# EAGLE design BC_proto (EAGLE 9.0.0)
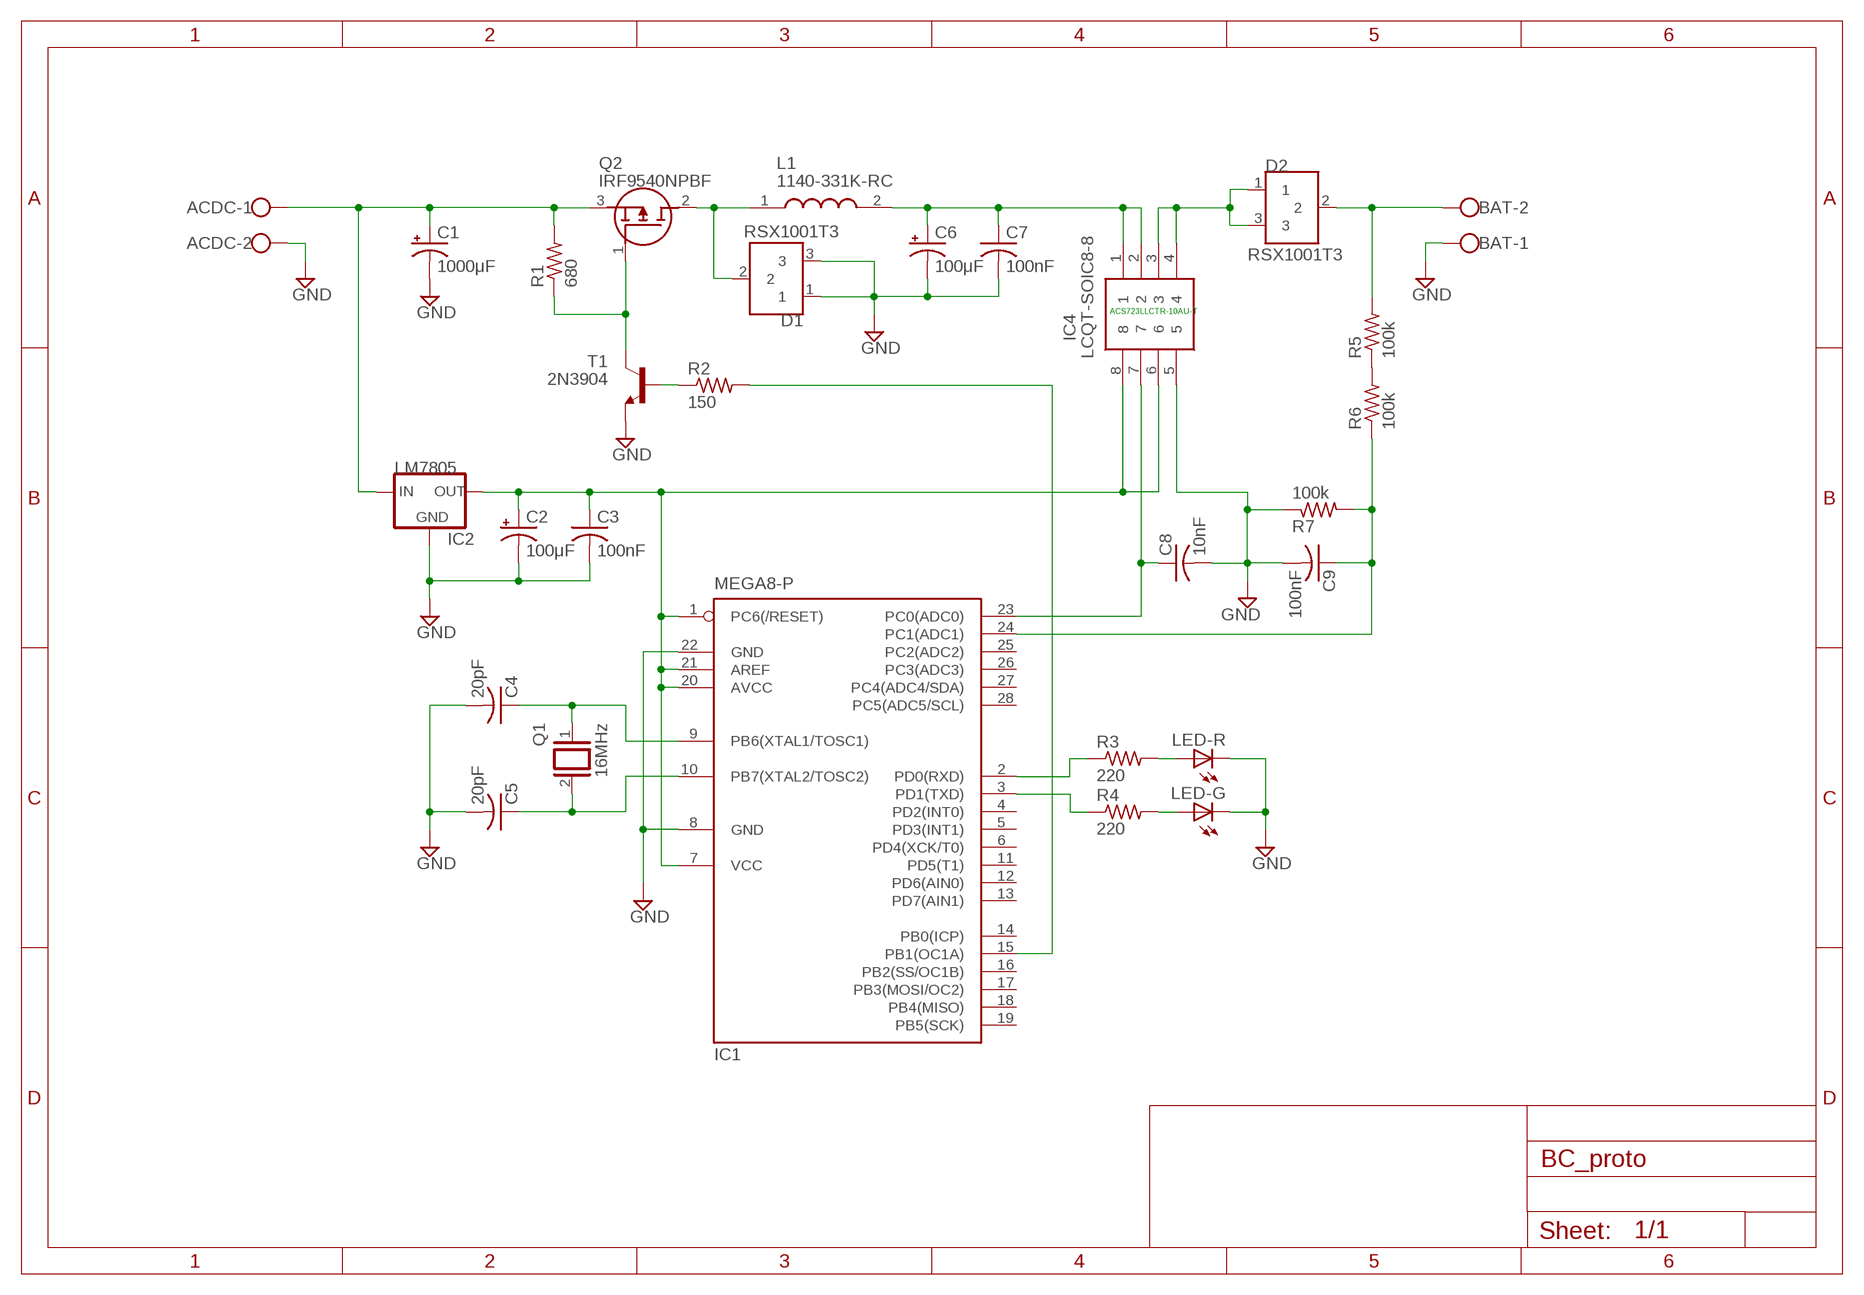
[diagram p0: schematic, sheet 1]

## Parts
ACDC  W237-102  [W237-102]
BAT  W237-102  [W237-102]
C1  1000μF  CPOL-USE7.5-16  [E7,5-16]
C2  100μF  CPOL-USE2,5-6E  [E2,5-6E]
C3  100nF  C-US050-024X044  [C050-024X044]
C4  20pF  C-US050-024X044  [C050-024X044]
C5  20pF  C-US050-024X044  [C050-024X044]
C6  100μF  CPOL-USE2,5-6E  [E2,5-6E]
C7  100nF  C-US050-024X044  [C050-024X044]
C8  10nF  C-US050-024X044  [C050-024X044]
C9  100nF  C-US050-024X044  [C050-024X044]
D1  RSX1001T3  [RSX1001T3]
D2  RSX1001T3  [RSX1001T3]
IC1  MEGA8-P  [DIL28-3]
IC2  LM7805  78XXS  [78XXS]
IC4  LCQT-SOIC8-8  W9501RC  [DIPS762W46P254L1016H160Q8N]
L1  1140-331K-RC  [1140-331K-RC]
LED-G  TLLR4400  [LED3MM]
LED-R  TLLR4400  [LED3MM]
Q1  16MHz  XTAL/S  [QS]
Q2  IRF9540NPBF  [TO254P469X1042X1967-3P]
R1  680  R-US_0204/7  [0204/7]
R2  150  R-US_0204/7  [0204/7]
R3  220  R-US_0204/7  [0204/7]
R4  220  R-US_0204/7  [0204/7]
R5  100k  R-US_0204/7  [0204/7]
R6  100k  R-US_0204/7  [0204/7]
R7  100k  R-US_0204/7  [0204/7]
T1  2N3904  [TO92]

## Nets
BUCK_OUT1: C6.+ C7.1 IC4.1 IC4.2 L1.2
BUCK_OUT2: D2.1 D2.3 IC4.3 IC4.4
BUCK_PWM1: IC1.15(PB1(OC1A)) R2.2
BUCK_PWM2: Q2.1(G) R1.1 T1.1(C)
C_SENSE: C8.1 IC1.23(PC0(ADC0)) IC4.7
GND: ACDC.2 BAT.1 C1.- C2.- C3.2 C4.2 C5.2 C6.- C7.2 C8.2 C9.2 D1.1 D1.3 IC1.8(GND) IC1.22(GND) IC2.GND IC4.5 LED-G.K(C) LED-R.K(C) R7.1 T1.3(E)
LOGIC_PWR: C2.+ C3.1 IC1.1(PC6(/RESET)) IC1.7(VCC) IC1.20(AVCC) IC1.21(AREF) IC2.OUT IC4.6 IC4.8
N$3: R2.1 T1.2(B)
N$4: C4.1 IC1.9(PB6(XTAL1/TOSC1)) Q1.1
N$5: C5.1 IC1.10(PB7(XTAL2/TOSC2)) Q1.2
N$7: IC1.2(PD0(RXD)) R3.1
N$8: IC1.3(PD1(TXD)) R4.1
N$9: LED-R.A R3.2
N$10: LED-G.A R4.2
N$13: R5.1 R6.2
N$16: D1.2 L1.1 Q2.2(D)
PWR_IN: ACDC.1 C1.+ IC2.IN Q2.3(S) R1.2
PWR_OUT: BAT.2 D2.2 R5.2
V_SENSE: C9.1 IC1.24(PC1(ADC1)) R6.1 R7.2
Unconnected: IC1.4(PD2(INT0)) IC1.5(PD3(INT1)) IC1.6(PD4(XCK/T0)) IC1.11(PD5(T1)) IC1.12(PD6(AIN0)) IC1.13(PD7(AIN1)) IC1.14(PB0(ICP)) IC1.16(PB2(SS/OC1B)) IC1.17(PB3(MOSI/OC2)) IC1.18(PB4(MISO)) IC1.19(PB5(SCK)) IC1.25(PC2(ADC2)) IC1.26(PC3(ADC3)) IC1.27(PC4(ADC4/SDA)) IC1.28(PC5(ADC5/SCL))

## Notes on the sheet
- ACS723LLCTR-10AU-T

## Library data of the parts
ACDC BAT = con-wago-500:W237-102: WAGO SCREW CLAMP; MPN: 237-102; OC_FARNELL: unknown; OC_NEWARK: 70K9898
C1 C2 C6 = rcl:CPOL-US: POLARIZED CAPACITOR, American symbol; SPICEPREFIX: C
C3-C5 C7-C9 = rcl:C-US: CAPACITOR, American symbol; SPICEPREFIX: C
D1 D2 = rasm_parts:RSX1001T3
IC1 = atmel:MEGA8-P: MICROCONTROLLER 8 Kbytes FLASH, 1 kbytes SRAM, 512 bytes EEPROM, USART, 4-channel 10 bit ADC, 2-channel 8 bit ADC Pin compatible with Atmega48, ATMega88, ATMega168 Source: avr.lbr; OC_FARNELL: unknown; OC_NEWARK: unknown
IC2 = v-reg:78XXS: VOLTAGE REGULATOR
IC4 = rasm_parts:W9501RC: 8 way 0.237in SOIC to 0.3in DIL socket Winslow Straight Through Hole Mount 1.27 mm, 2.54 mm Pitch IC Socket Adapter, 8 Pin Female SOP to 8 Pin Male DIP Source: Datasheet <http://docs-europe.electrocomponents.com/webdocs/0ff4/0900766b80ff4d69.pdf>; ALLIED_NUMBER: R1002010; ALLIED_PRICE/STOCK: https://www.alliedelec.com/winslow-adaptics-w9501rc/R1002010/; ARROW_PART_NUMBER: W9501RC; ARROW_PRICE/STOCK: http://uk.rs-online.com/web/p/products/1582878; DESCRIPTION: 8 way 0.237in SOIC to 0.3in DIL socket Winslow Straight Through Hole Mount 1.27 mm, 2.54 mm Pitch IC Socket Adapter, 8 Pin Female SOP to 8 Pin Male DIP; HEIGHT: 1.6mm; MANUFACTURER_NAME: Winslow; MANUFACTURER_PART_NUMBER: W9501RC; RS_PART_NUMBER: 1582878; RS_PRICE/STOCK: http://uk.rs-online.com/web/p/products/1582878
L1 = rasm_parts:1140-331K-RC: Bourns 330 H 10% Ferrite Bobbin Core Power Inductor, 6.1A Idc, 74m Rdc 1140 Source: Datasheet <http://www.bourns.com/docs/Product-Datasheets/1140_series.pdf>; ARROW_PART_NUMBER: 1140-331K-RC; ARROW_PRICE/STOCK: https://www.arrow.com/en/products/1140-331k-rc/bourns; DESCRIPTION: Bourns 330 H 10% Ferrite Bobbin Core Power Inductor, 6.1A Idc, 74m Rdc 1140; HEIGHT: mm; MANUFACTURER_NAME: Bourns; MANUFACTURER_PART_NUMBER: 1140-331K-RC; RS_PART_NUMBER: 1728697; RS_PRICE/STOCK: http://uk.rs-online.com/web/p/products/1728697
LED-G LED-R = led:TLLR4400: Low Current (2mA) LED 3 mm Tinted Diffused Package color RED Source: Data sheet <http://www.farnell.com/datasheets/391100.pdf>; MF: VISHAY SEMICONDUCTOR; OC_FARNELL: 1612437
Q1 = special:XTAL/S: CRYSTAL
Q2 = rasm_parts:IRF9540NPBF: Infineon IRF9540NPBF P-channel MOSFET, 23 A, 100 V HEXFET, 3-Pin TO-220AB Source: Datasheet <https://www.infineon.com/dgdl/irf9540npbf.pdf?fileId=5546d462533600a401535611cfa21dc8>; ARROW_PART_NUMBER: IRF9540NPBF; ARROW_PRICE/STOCK: https://www.arrow.com/en/products/irf9540npbf/infineon-technologies-ag; DESCRIPTION: Infineon IRF9540NPBF P-channel MOSFET, 23 A, 100 V HEXFET, 3-Pin TO-220AB; HEIGHT: 4.69mm; MANUFACTURER_NAME: Infineon; MANUFACTURER_PART_NUMBER: IRF9540NPBF; RS_PART_NUMBER: 5411225P; RS_PRICE/STOCK: http://uk.rs-online.com/web/p/products/5411225P
R1-R7 = rcl:R-US_: RESISTOR, American symbol; SPICEPREFIX: R
T1 = transistor:2N3904: NPN TRANSISTOR

## Net classes
0 default: width 0.254 mm

## Board
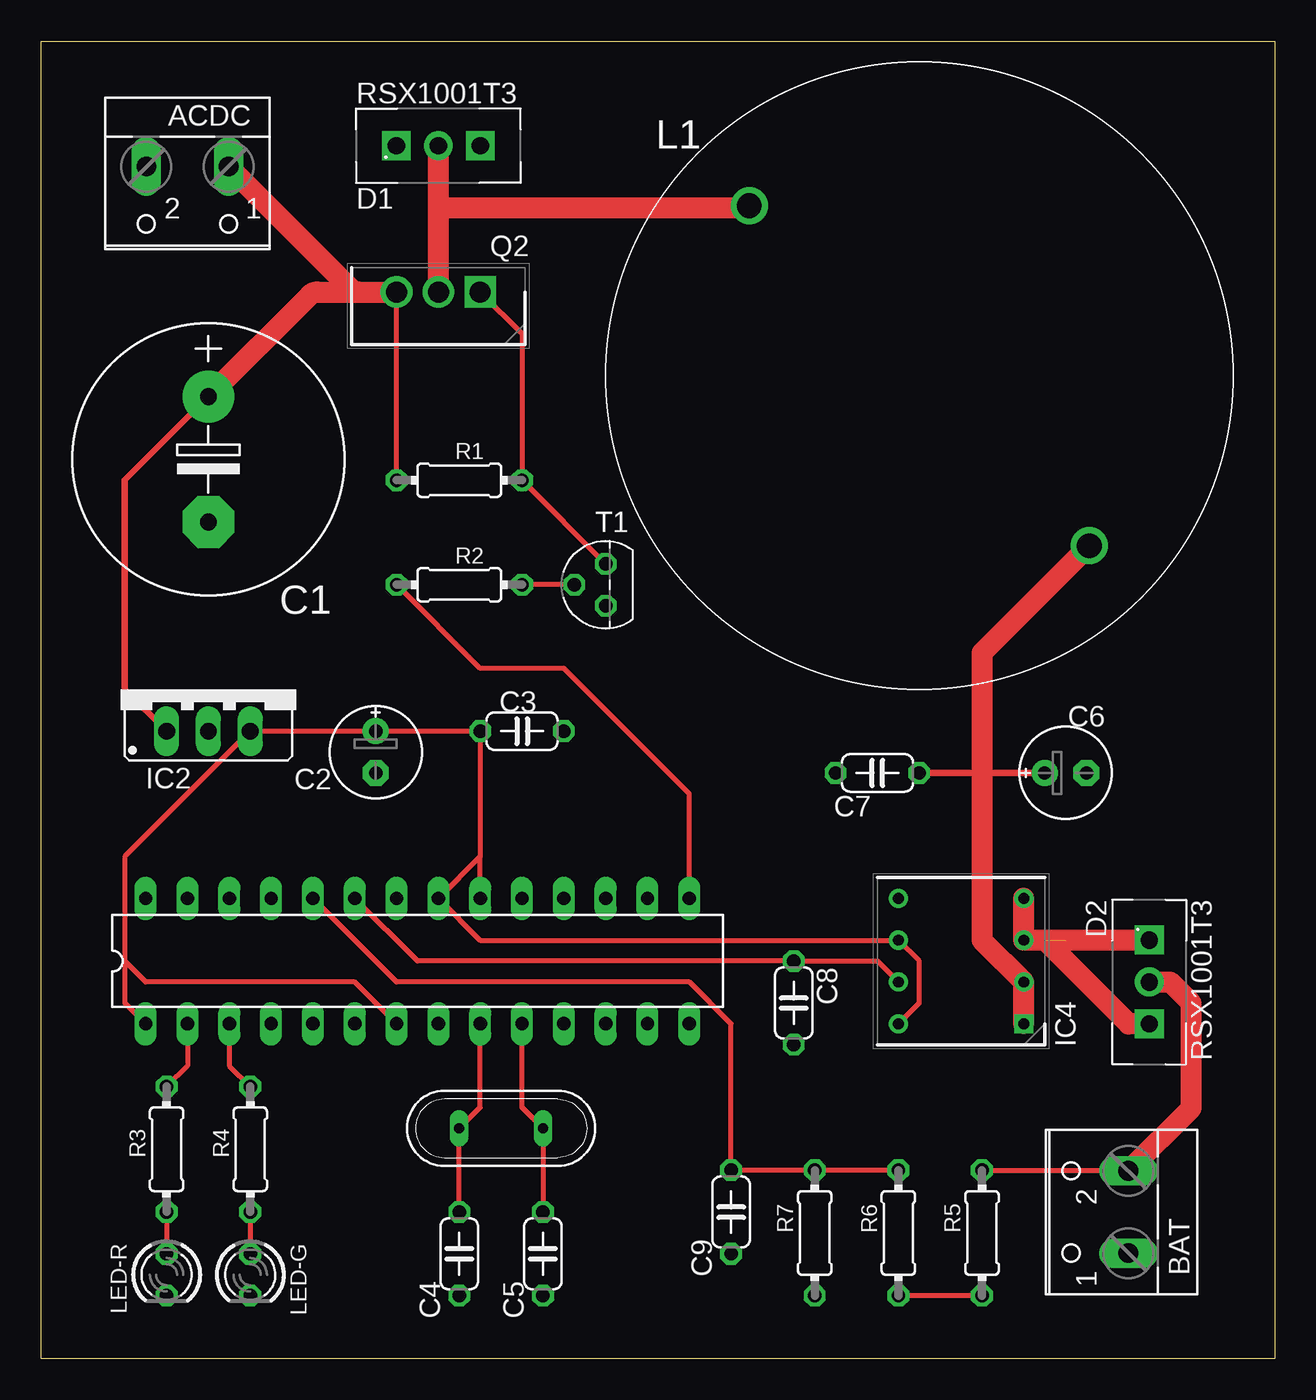
[diagram p1: board, top side]
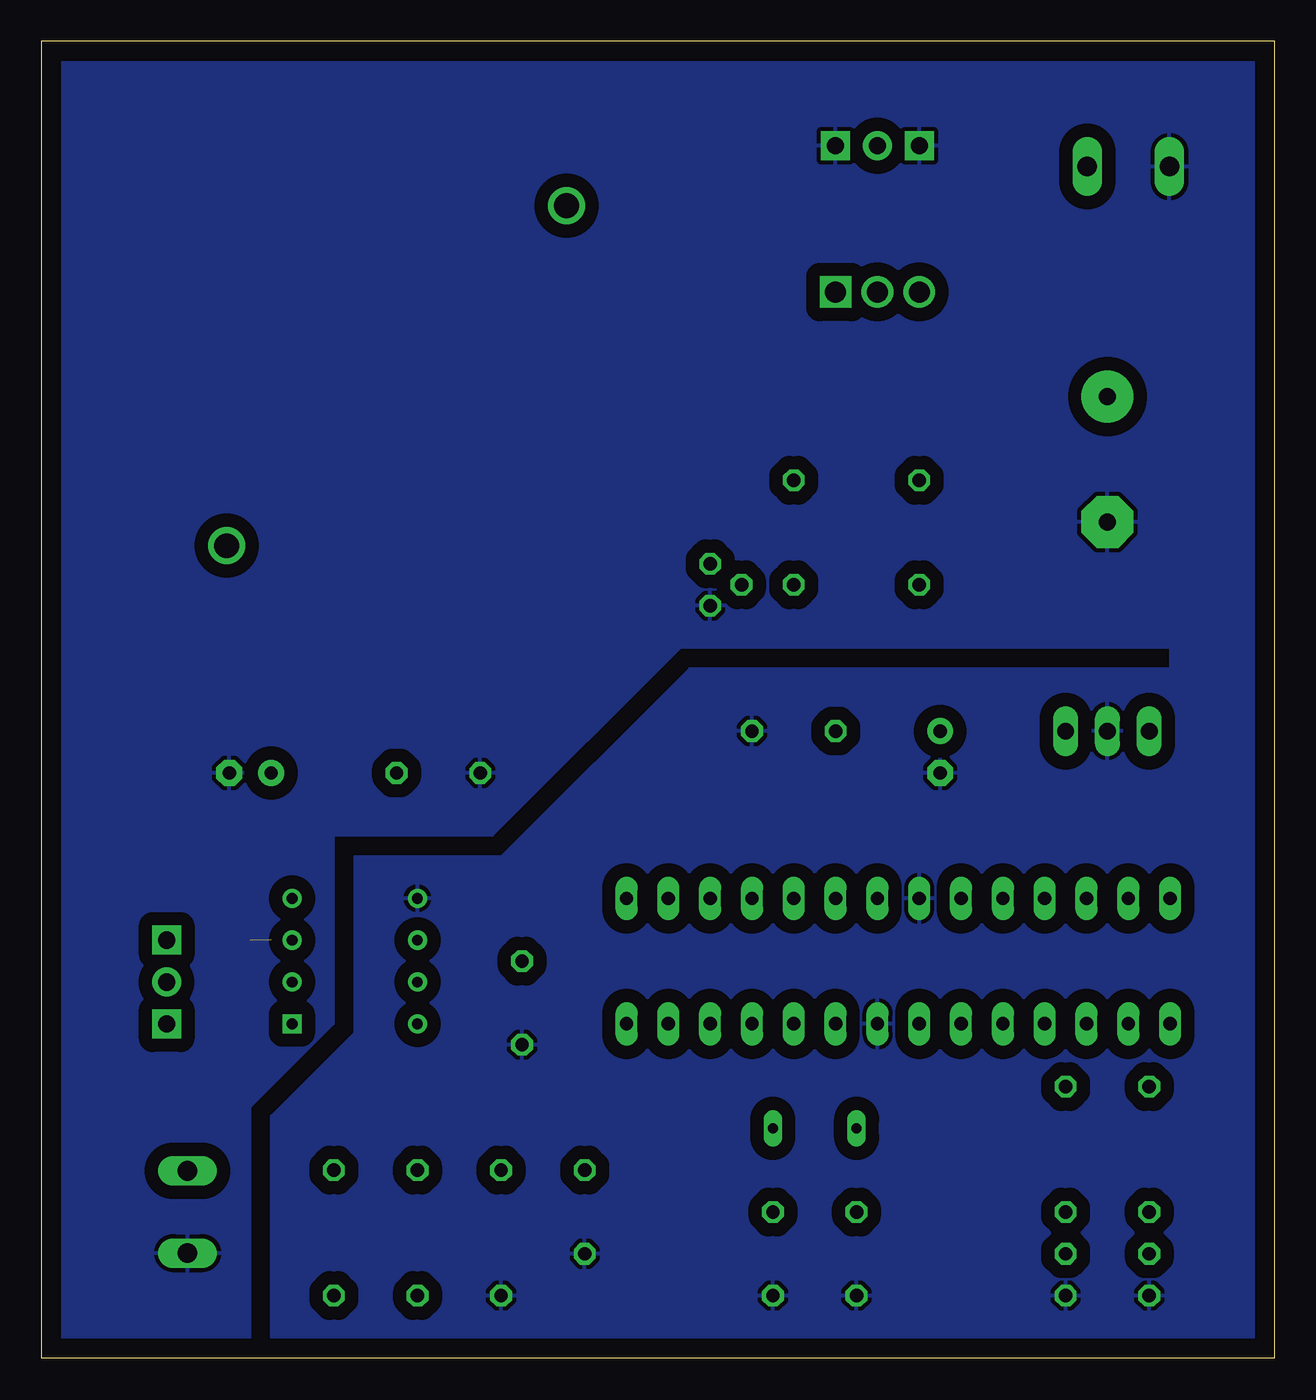
[diagram p2: board, bottom side, seen from below]

Size 74.93 x 80.01 mm. Coordinates in mm from the lower left corner, seen from the top.
Outline: 74.93,80.01 74.93,0 0,0 0,80.01 74.93,80.01
Copper layers (1*16): Top 0.035mm / dielectric 1.5mm / Bottom 0.035mm
Design rules "default": minimum track width 6mil, minimum drill 0.35mm, track to track 6mil, track to pad 6mil, pad to pad 6mil, via to via 6mil, smd to smd 6mil, copper to edge 40mil, drill to drill 6mil, minimum pad ring 10mil, minimum via ring 8mil, stop-mask expansion 4mil, vias tented up to drill 0mil, thermal gap 10mil

### Footprints (pad centres in the part's own frame; a part is rotated, then mirrored left to right if it is on the bottom)
W237-102 = drill 1.194 long: 1 -2.5,-1.27; 2 2.5,-1.27
E7,5-16 = drill 1.016 pad 3.15: + -3.81,0 | drill 1.016 pad 3.15 octagon: - 3.81,0
E2,5-6E = drill 0.813 pad 1.575: + -1.27,0 | drill 0.813 pad 1.575 octagon: - 1.27,0
C050-024X044 = drill 0.813 octagon: 1 -2.54,0; 2 2.54,0
RSX1001T3 = drill 1.05 pad 1.75 square: 1 -2.55,0; 3 2.55,0 | drill 1.05 pad 1.75: 2 0,0
DIL28-3 = drill 0.813 long: 1 -16.51,-3.81; 2 -13.97,-3.81; 3 -11.43,-3.81; 4 -8.89,-3.81; 5 -6.35,-3.81; 6 -3.81,-3.81; 7 -1.27,-3.81; 8 1.27,-3.81; 9 3.81,-3.81; 10 6.35,-3.81; 11 8.89,-3.81; 12 11.43,-3.81; 13 13.97,-3.81; 14 16.51,-3.81; 15 16.51,3.81; 16 13.97,3.81; 17 11.43,3.81; 18 8.89,3.81; 19 6.35,3.81; 20 3.81,3.81; 21 1.27,3.81; 22 -1.27,3.81; 23 -3.81,3.81; 24 -6.35,3.81; 25 -8.89,3.81; 26 -11.43,3.81; 27 -13.97,3.81; 28 -16.51,3.81
78XXS = drill 1.016 long: GND 0,-2.54; IN -2.54,-2.54; OUT 2.54,-2.54
DIPS762W46P254L1016H160Q8N = drill 0.65 pad 1.05 square: 1 0,0 | drill 0.65 pad 1.05: 2 0,-2.54; 3 0,-5.08; 4 0,-7.62; 5 7.62,-7.62; 6 7.62,-5.08; 7 7.62,-2.54; 8 7.62,0
1140-331K-RC = drill 1.5 pad 2.2: 1 -14.605,0; 2 14.605,0
LED3MM = drill 0.813 octagon: A -1.27,0; K 1.27,0
QS = drill 0.61 long: 1 -2.54,0; 2 2.54,0
TO254P469X1042X1967-3P = drill 1.28 pad 1.92 square: 1 0,0 | drill 1.28 pad 1.92: 2 2.54,0; 3 5.08,0
0204/7 = drill 0.813 octagon: 1 -3.81,0; 2 3.81,0
TO92 = drill 0.813 octagon: 1 1.27,0; 2 0,1.905; 3 -1.27,0

### Placement (x,y rotation side)
ACDC  8.89,71.12 180 top
BAT  64.77,8.89 90 top
C1  10.16,54.61 270 top
C2  20.32,36.83 270 top
C3  29.21,38.1 0 top
C4  25.4,6.35 270 top
C5  30.48,6.35 270 top
C6  62.23,35.56 0 top
C7  50.8,35.56 180 top
C8  45.72,21.59 270 top
C9  41.91,8.89 270 top
D1  24.13,73.66 0 top
D2  67.31,22.86 270 top
IC1  22.86,24.13 0 top
IC2  10.16,40.64 0 top
IC4  59.69,20.32 180 top
L1  53.34,59.69 315 top
LED-G  12.7,5.08 270 top
LED-R  7.62,5.08 270 top
Q1  27.94,13.97 0 top
Q2  26.67,64.77 180 top
R1  25.4,53.34 180 top
R2  25.4,46.99 180 top
R3  7.62,12.7 270 top
R4  12.7,12.7 270 top
R5  57.15,7.62 90 top
R6  52.07,7.62 270 top
R7  46.99,7.62 90 top
T1  34.29,46.99 90 top

### Tracks (layer width: path | path; a pad name or v marks a point on that pad's centre or on a via)
BUCK_OUT1
  Top 0.406: C7.1 57.15,35.56 C6.+
  Top 1.27: L1.2 57.15,42.84 57.15,35.56 57.15,25.4 IC4.2 IC4.1
BUCK_OUT2  (1 unrouted)
  Top 0.152: 62.23,25.39 62.23,25.41
  Top 1.27: IC4.4 IC4.3 60.96,25.41 | 60.96,25.41 D2.1 | D2.3 66.06,20.31 60.96,25.41
BUCK_PWM1
  Top 0.305: IC1.15 39.37,34.29 31.75,41.91 26.67,41.91 R2.2
BUCK_PWM2
  Top 0.305: Q2.1 29.21,62.23 R1.1 T1.1
C_SENSE
  Top 0.305: IC1.23 22.86,24.13 C8.1 50.8,24.13 IC4.7
GND
  pour Bottom (isolate 0.813): 1.27,78.74 73.66,78.74 73.66,1.27 62.23,1.27 62.23,15.24 57.15,20.32 57.15,31.75 47.5,31.75 36.07,43.18 6.35,43.18 6.35,41.91 35.56,41.91 46.99,30.48 55.88,30.48 55.88,19.81 60.96,14.73 60.96,1.27 1.27,1.27
LOGIC_PWR
  Top 0.305: 26.67,30.48 C3.1 C2.+ IC2.OUT 5.08,30.48 5.08,24.13 | 26.67,30.48 IC1.21 26.67,25.4 IC4.6 53.34,24.13 53.34,21.59 IC4.8 | IC1.20 26.67,30.48 | 5.08,24.13 5.08,21.59 IC1.1 | IC1.7 19.05,22.86 6.35,22.86 5.08,24.13
N$3
  Top 0.305: T1.2 R2.1
N$4
  Top 0.305: C4.1 Q1.1 26.67,15.24 IC1.9
N$5
  Top 0.305: C5.1 Q1.2 29.21,15.24 IC1.10
N$7
  Top 0.305: IC1.2 8.89,17.78 R3.1
N$8
  Top 0.305: IC1.3 11.43,17.78 R4.1
N$9
  Top 0.305: R3.2 LED-R.A
N$10
  Top 0.305: R4.2 LED-G.A
N$13
  Top 0.305: R5.1 R6.2
N$16
  Top 1.27: Q2.2 24.13,69.85 | 24.13,69.85 D1.2 | L1.1 arc-90 42.84,69.85 24.13,69.85
PWR_IN
  Top 0.152: ACDC.1 11.39,72.35
  Top 0.305: R1.2 Q2.3
  Top 0.406: IC2.IN 5.08,40.64 5.08,53.34 C1.+
  Top 1.27: ACDC.1 18.82,64.96 arc45 19.27,64.77 | 19.27,64.77 Q2.3 | C1.+ 16.32,64.58 arc-45 16.77,64.77 19.27,64.77
PWR_OUT
  Top 0.152: BAT.2 66.06,11.41 66.04,11.43
  Top 0.305: R5.2 66.04,11.43
  Top 1.27: D2.2 68.58,22.86 69.85,21.59 69.85,15.2 BAT.2
V_SENSE
  Top 0.305: R6.1 R7.2 C9.1 41.91,20.32 39.37,22.86 21.59,22.86 IC1.24